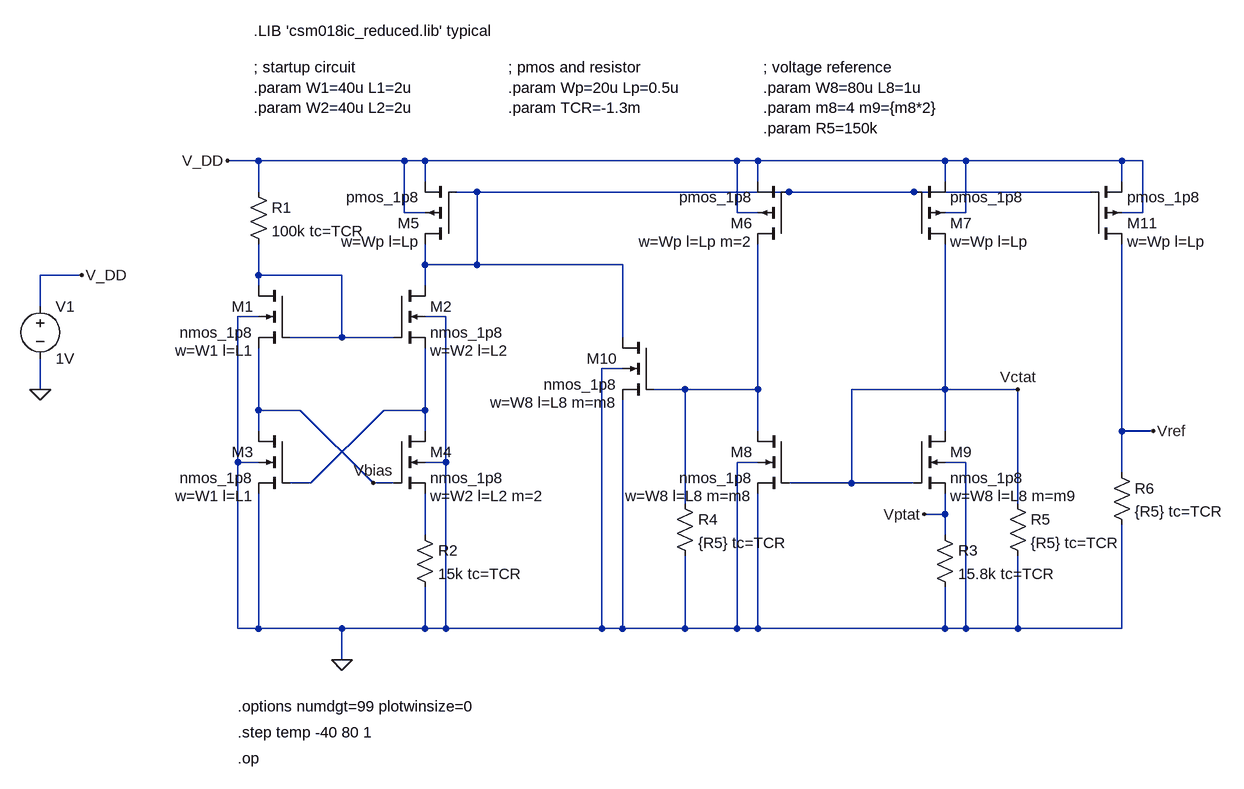
[diagram p0: schematic voltage_ref.asc]
voltage_ref.asc, the LTspice schematic file:
Version 4
SHEET 1 2776 792
WIRE 144 -144 96 -144
WIRE 368 -144 144 -144
WIRE 400 -144 368 -144
WIRE 880 -144 400 -144
WIRE 912 -144 880 -144
WIRE 1200 -144 912 -144
WIRE 1232 -144 1200 -144
WIRE 1472 -144 1232 -144
WIRE 1504 -144 1472 -144
WIRE 400 -112 400 -144
WIRE 912 -112 912 -144
WIRE 1200 -112 1200 -144
WIRE 1472 -112 1472 -144
WIRE 144 -96 144 -144
WIRE 480 -96 448 -96
WIRE 960 -96 480 -96
WIRE 1152 -96 960 -96
WIRE 1424 -96 1152 -96
WIRE 368 -64 368 -144
WIRE 400 -64 368 -64
WIRE 880 -64 880 -144
WIRE 912 -64 880 -64
WIRE 1232 -64 1232 -144
WIRE 1232 -64 1200 -64
WIRE 1504 -64 1504 -144
WIRE 1504 -64 1472 -64
WIRE 400 16 400 -16
WIRE 480 16 480 -96
WIRE 480 16 400 16
WIRE 704 16 480 16
WIRE -128 32 -192 32
WIRE 144 32 144 -16
WIRE 272 32 144 32
WIRE 144 48 144 32
WIRE 400 48 400 16
WIRE -192 80 -192 32
WIRE 144 96 112 96
WIRE 432 96 400 96
WIRE 272 128 272 32
WIRE 272 128 192 128
WIRE 352 128 272 128
WIRE 704 128 704 16
WIRE 704 176 672 176
WIRE -192 208 -192 160
WIRE 800 208 752 208
WIRE 912 208 912 -16
WIRE 912 208 800 208
WIRE 1200 208 1200 -16
WIRE 1200 208 1056 208
WIRE 1312 208 1200 208
WIRE 144 240 144 144
WIRE 208 240 144 240
WIRE 400 240 400 144
WIRE 400 240 336 240
WIRE 144 272 144 240
WIRE 400 272 400 240
WIRE 912 272 912 208
WIRE 1200 272 1200 208
WIRE 1472 272 1472 -16
WIRE 1520 272 1472 272
WIRE 112 320 112 96
WIRE 144 320 112 320
WIRE 432 320 432 96
WIRE 432 320 400 320
WIRE 912 320 880 320
WIRE 1232 320 1200 320
WIRE 1472 336 1472 272
WIRE 224 352 336 240
WIRE 224 352 192 352
WIRE 320 352 208 240
WIRE 352 352 320 352
WIRE 1056 352 1056 208
WIRE 1056 352 960 352
WIRE 1152 352 1056 352
WIRE 800 384 800 208
WIRE 1312 384 1312 208
WIRE 1200 400 1200 368
WIRE 1200 400 1168 400
WIRE 400 432 400 368
WIRE 1200 432 1200 400
WIRE 112 576 112 320
WIRE 144 576 144 368
WIRE 144 576 112 576
WIRE 272 576 144 576
WIRE 400 576 400 512
WIRE 400 576 272 576
WIRE 432 576 432 320
WIRE 432 576 400 576
WIRE 672 576 672 176
WIRE 672 576 432 576
WIRE 704 576 704 224
WIRE 704 576 672 576
WIRE 800 576 800 464
WIRE 800 576 704 576
WIRE 880 576 880 320
WIRE 880 576 800 576
WIRE 912 576 912 368
WIRE 912 576 880 576
WIRE 1200 576 1200 512
WIRE 1200 576 912 576
WIRE 1232 576 1232 320
WIRE 1232 576 1200 576
WIRE 1312 576 1312 464
WIRE 1312 576 1232 576
WIRE 1472 576 1472 416
WIRE 1472 576 1312 576
WIRE 272 624 272 576
FLAG 96 -144 V_DD
FLAG -192 208 0
FLAG -128 32 V_DD
FLAG 272 624 0
FLAG 1168 400 Vptat
FLAG 1312 208 Vctat
FLAG 1520 272 Vref
FLAG 320 352 Vbias
SYMBOL nmos4 192 48 M0
WINDOW 123 56 100 Left 2
SYMATTR Value2 w=W1 l=L1
SYMATTR InstName M1
SYMATTR Value nmos_1p8
SYMBOL nmos4 192 272 M0
WINDOW 123 56 100 Left 2
SYMATTR Value2 w=W1 l=L1
SYMATTR InstName M3
SYMATTR Value nmos_1p8
SYMBOL nmos4 352 48 R0
WINDOW 123 56 100 Left 2
SYMATTR Value2 w=W2 l=L2
SYMATTR InstName M2
SYMATTR Value nmos_1p8
SYMBOL nmos4 352 272 R0
WINDOW 123 56 100 Left 2
SYMATTR Value2 w=W2 l=L2 m=2
SYMATTR InstName M4
SYMATTR Value nmos_1p8
SYMBOL res 128 -112 R0
SYMATTR InstName R1
SYMATTR Value 100k tc=TCR
SYMBOL res 384 416 R0
SYMATTR InstName R2
SYMATTR Value 15k tc=TCR
SYMBOL voltage -192 64 R0
WINDOW 123 0 0 Left 0
WINDOW 39 0 0 Left 0
SYMATTR InstName V1
SYMATTR Value 1V
SYMBOL pmos4 960 -16 R180
WINDOW 123 56 4 Left 2
SYMATTR Value2 w=Wp l=Lp m=2
SYMATTR InstName M6
SYMATTR Value pmos_1p8
SYMBOL pmos4 1152 -16 M180
WINDOW 123 56 4 Left 2
SYMATTR Value2 w=Wp l=Lp
SYMATTR InstName M7
SYMATTR Value pmos_1p8
SYMBOL nmos4 960 272 M0
WINDOW 123 56 100 Left 2
SYMATTR Value2 w=W8 l=L8 m=m8
SYMATTR InstName M8
SYMATTR Value nmos_1p8
SYMBOL nmos4 1152 272 R0
WINDOW 123 56 100 Left 2
SYMATTR Value2 w=W8 l=L8 m=m9
SYMATTR InstName M9
SYMATTR Value nmos_1p8
SYMBOL nmos4 752 128 M0
WINDOW 123 56 100 Left 2
SYMATTR Value2 w=W8 l=L8 m=m8
SYMATTR InstName M10
SYMATTR Value nmos_1p8
SYMBOL res 1184 416 R0
SYMATTR InstName R3
SYMATTR Value 15.8k tc=TCR
SYMBOL res 784 368 R0
SYMATTR InstName R4
SYMATTR Value {R5} tc=TCR
SYMBOL res 1296 368 R0
SYMATTR InstName R5
SYMATTR Value {R5} tc=TCR
SYMBOL pmos4 448 -16 R180
WINDOW 123 56 4 Left 2
SYMATTR Value2 w=Wp l=Lp
SYMATTR InstName M5
SYMATTR Value pmos_1p8
SYMBOL pmos4 1424 -16 M180
WINDOW 123 56 4 Left 2
SYMATTR Value2 w=Wp l=Lp
SYMATTR InstName M11
SYMATTR Value pmos_1p8
SYMBOL res 1456 320 R0
SYMATTR InstName R6
SYMATTR Value {R5} tc=TCR
TEXT 136 -344 Left 2 !.LIB 'csm018ic_reduced.lib' typical
TEXT 112 696 Left 2 !.options numdgt=99 plotwinsize=0
TEXT 136 -288 Left 2 !; startup circuit\n.param W1=40u L1=2u\n.param W2=40u L2=2u
TEXT 112 776 Left 2 !.op
TEXT 112 736 Left 2 !.step temp -40 80 1
TEXT 920 -288 Left 2 !; voltage reference\n.param W8=80u L8=1u\n.param m8=4 m9={m8*2}\n.param R5=150k
TEXT 528 -288 Left 2 !; pmos and resistor\n.param Wp=20u Lp=0.5u\n.param TCR=-1.3m

The netlist it stands for:
* voltage_ref.asc
M1 N002 N002 Vbias 0 nmos_1p8 w=W1 l=L1
M3 Vbias N004 0 0 nmos_1p8 w=W1 l=L1
M2 N001 N002 N004 0 nmos_1p8 w=W2 l=L2
M4 N004 Vbias N005 0 nmos_1p8 w=W2 l=L2 m=2
R1 V_DD N002 100k tc=TCR
R2 N005 0 15k tc=TCR
V1 V_DD 0 1V
M6 N003 N001 V_DD V_DD pmos_1p8 w=Wp l=Lp m=2
M7 Vctat N001 V_DD V_DD pmos_1p8 w=Wp l=Lp
M8 N003 Vctat 0 0 nmos_1p8 w=W8 l=L8 m=m8
M9 Vctat Vctat Vptat 0 nmos_1p8 w=W8 l=L8 m=m9
M10 N001 N003 0 0 nmos_1p8 w=W8 l=L8 m=m8
R3 Vptat 0 15.8k tc=TCR
R4 N003 0 {R5} tc=TCR
R5 Vctat 0 {R5} tc=TCR
M5 N001 N001 V_DD V_DD pmos_1p8 w=Wp l=Lp
M11 Vref N001 V_DD V_DD pmos_1p8 w=Wp l=Lp
R6 Vref 0 {R5} tc=TCR
.model NMOS NMOS
.model PMOS PMOS
.lib standard.mos
.LIB 'csm018ic_reduced.lib' typical
.options numdgt=99 plotwinsize=0
; startup circuit
.param W1=40u L1=2u
.param W2=40u L2=2u
.op
.step temp -40 80 1
; voltage reference
.param W8=80u L8=1u
.param m8=4 m9={m8*2}
.param R5=150k
; pmos and resistor
.param Wp=20u Lp=0.5u
.param TCR=-1.3m
.backanno
.end